# Altium schematic sheet cpu_nand.SchDoc: CPU I/O and NAND
size B; Engineer: Michael J. Kelly; Organization: CSB540otn - Outernet; Address1: AM335x Compute Board; Address2: (C) 2015; Address3: See us on the Web:; Address4: http://outernet.is; DocumentNumber: 3; Revision: V1.0; SheetNumber: 3; SheetTotal: 9
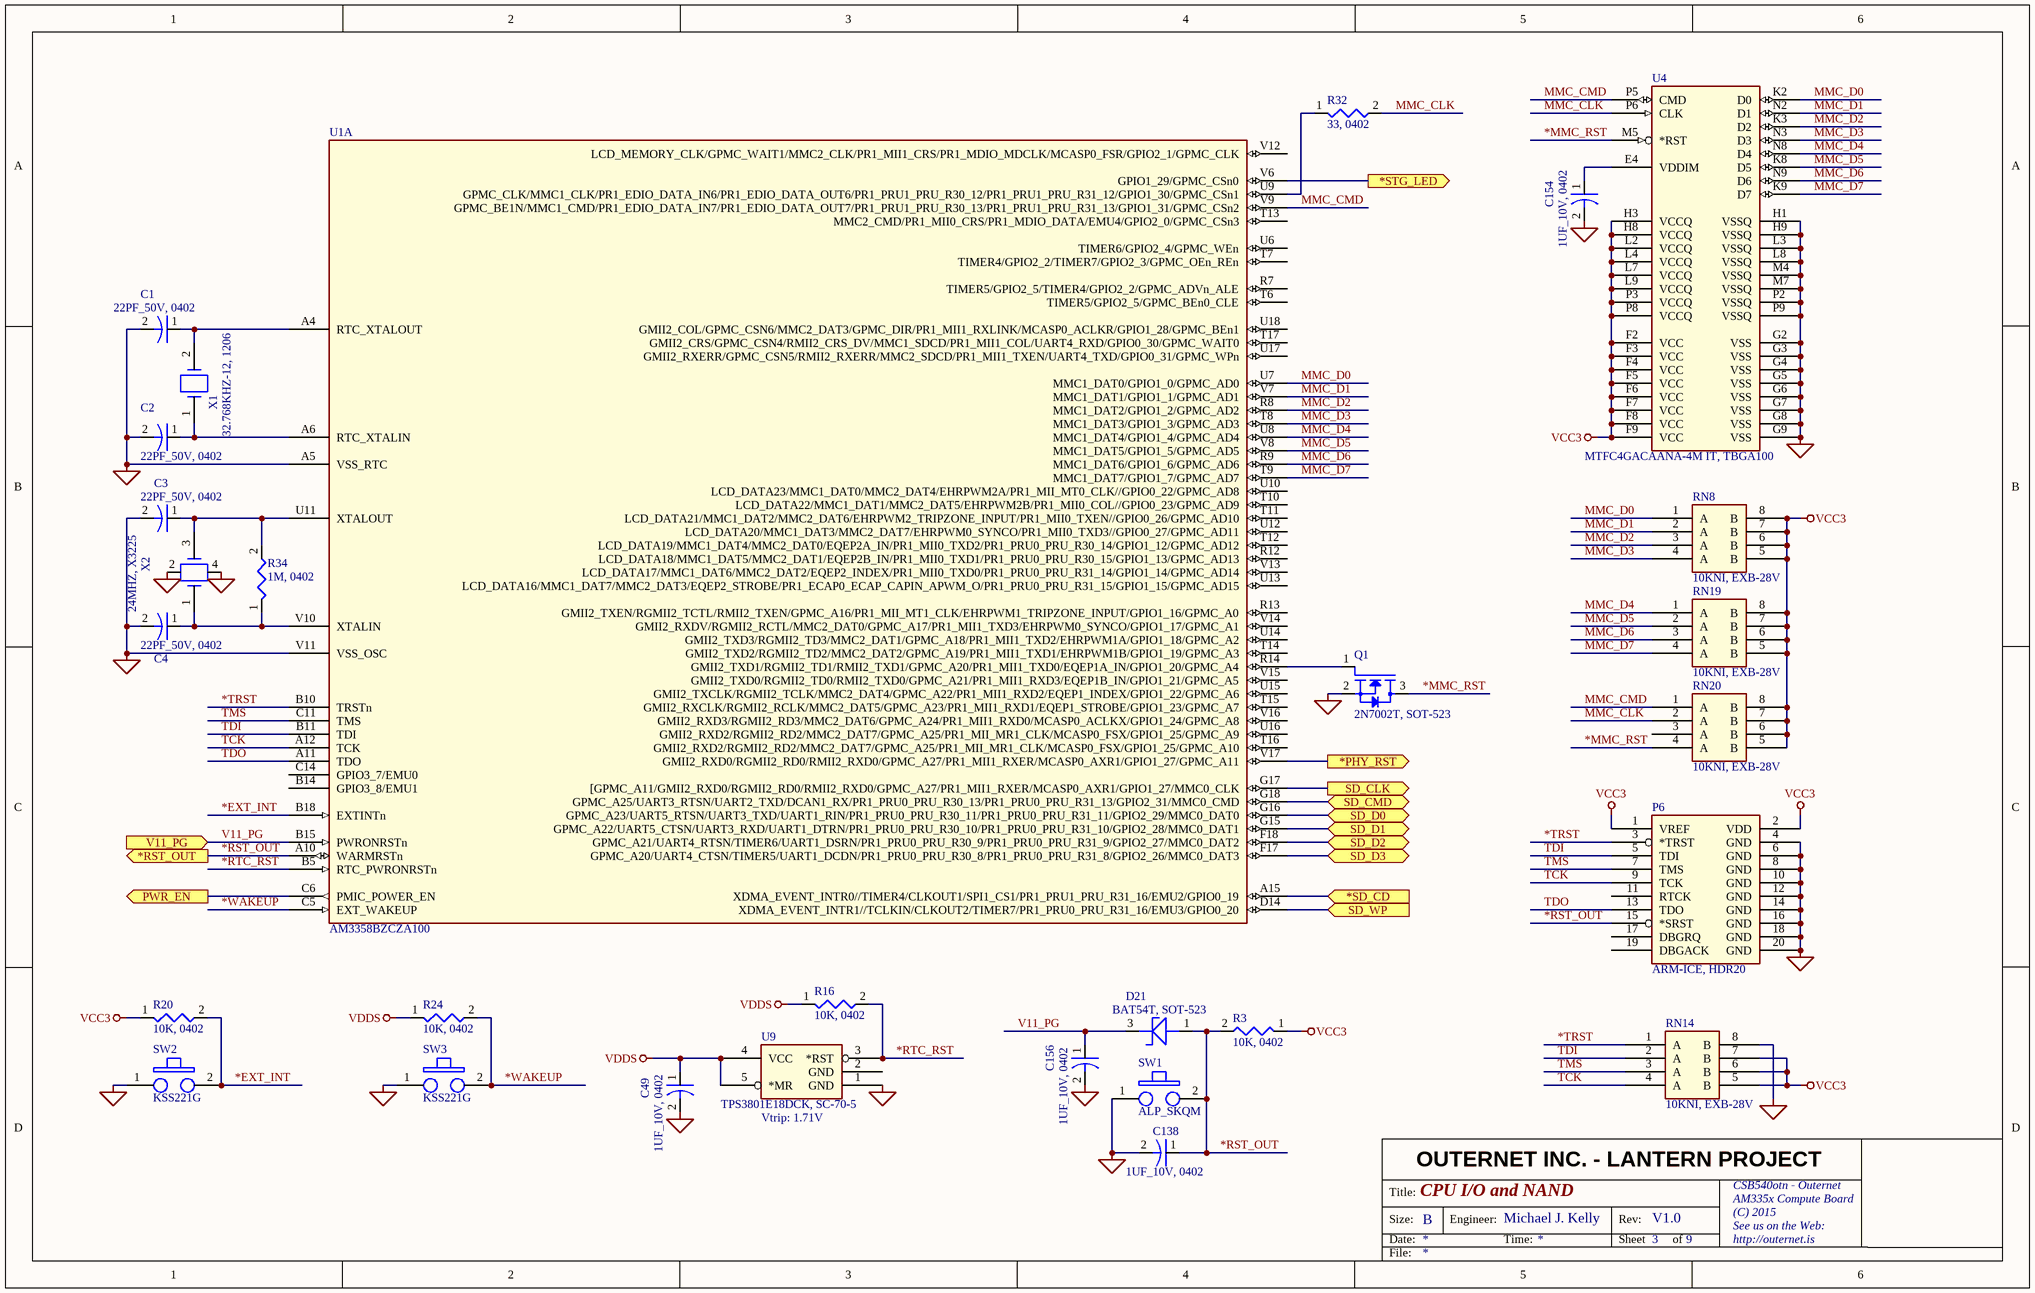
[diagram p0: cpu_nand.SchDoc]

## Parts
C1  22PF_50V, 0402  [0402C]
C2  22PF_50V, 0402  [0402C]
C3  22PF_50V, 0402  [0402C]
C4  22PF_50V, 0402  [0402C]
C49  1UF_10V, 0402  [0402C]
C138  1UF_10V, 0402  [0402C]
C154  1UF_10V, 0402  [0402C]
C156  1UF_10V, 0402  [0402C]
D21  BAT54T, SOT-523  [SOT-523]
P6  ARM-ICE, HDR20  [HDR20]
Q1  2N7002T, SOT-523  [SOT-523]
R3  10K, 0402  [0402R]
R16  10K, 0402  [0402R]
R20  10K, 0402  [0402R]
R24  10K, 0402  [0402R]
R32  33, 0402  [0402R]
R34  1M, 0402  [0402R]
RN8  10KNI, EXB-28V  [EXB-28V]
RN14  10KNI, EXB-28V  [EXB-28V]
RN19  10KNI, EXB-28V  [EXB-28V]
RN20  10KNI, EXB-28V  [EXB-28V]
SW1  ALP_SKQM  [ALPS_SKQM]
SW2  KSS221G  [KSS221G]
SW3  KSS221G  [KSS221G]
U1  AM3358BZCZA100  [BGA324x18]  (part A of 4)
U4  MTFC4GACAANA-4M IT, TBGA100  [TBGA100]
U9  TPS3801E18DCK, SC-70-5  Vtrip: 1.71V  [SOT-353/SC-70-5]
X1  32.768KHZ-12, 1206  [1206X]
X2  24MHZ, X3225  [X3225]

## Ports
*PHY_RST (out), *RST_OUT (out), *SD_CD (in), *STG_LED (out), PWR_EN (out), SD_CLK (out), SD_CMD (bidir), SD_D0 (bidir), SD_D1 (bidir), SD_D2 (bidir), SD_D3 (bidir), SD_WP (in), V11_PG (in)

## Nets
GND: C1.2 C2.2 C3.2 C4.2 C49.2 C138.2 C154.2 C156.2 P6.4(GND) P6.6(GND) P6.8(GND) P6.10(GND) P6.12(GND) P6.14(GND) P6.16(GND) P6.18(GND) P6.20(GND) Q1.2(SOURCE) RN14.8(B) SW1.1 SW2.1 SW3.1 U1.A5(VSS_RTC) U1.V11(VSS_OSC) U4.G2(VSS) U4.G3(VSS) U4.G4(VSS) U4.G5(VSS) U4.G6(VSS) U4.G7(VSS) U4.G8(VSS) U4.G9(VSS) U4.H1(VSSQ) U4.H9(VSSQ) U4.L3(VSSQ) U4.L8(VSSQ) U4.M4(VSSQ) U4.M7(VSSQ) U4.P2(VSSQ) U4.P9(VSSQ) U9.1(GND) X2.2 X2.4
VCC3: P6.1(VREF) P6.2(VDD) R3.1 R20.1 RN8.5(B) RN8.6(B) RN8.7(B) RN8.8(B) RN14.5(B) RN14.6(B) RN14.7(B) RN19.5(B) RN19.6(B) RN19.7(B) RN19.8(B) RN20.5(B) RN20.6(B) RN20.7(B) RN20.8(B) U4.F2(VCC) U4.F3(VCC) U4.F4(VCC) U4.F5(VCC) U4.F6(VCC) U4.F7(VCC) U4.F8(VCC) U4.F9(VCC) U4.H3(VCCQ) U4.H8(VCCQ) U4.L2(VCCQ) U4.L4(VCCQ) U4.L7(VCCQ) U4.L9(VCCQ) U4.P3(VCCQ) U4.P8(VCCQ)
VDDS: C49.1 R16.1 R24.1 U9.4(VCC) U9.5(*MR)
*EXT_INT: R20.2 SW2.2 U1.B18(EXTINTn)
*MMC_RST: Q1.3(DRAIN) RN20.4(A) U4.M5(*RST)
*PHY_RST: U1.V17(GMII2_RXD0/RGMII2_RD0/RMII2_RXD0/GPMC_A27/PR1_MII1_RXER/MCASP0_AXR1/GPIO1_27/GPMC_A11) ; port *PHY_RST
*RST_OUT: C138.1 D21.1(ANODE) P6.15(*SRST) R3.2 SW1.2 U1.A10(WARMRSTn) ; port *RST_OUT
*RTC_RST: R16.2 U1.B5(RTC_PWRONRSTn) U9.3(*RST)
*SD_CD: U1.A15(XDMA_EVENT_INTR0//TIMER4/CLKOUT1/SPI1_CS1/PR1_PRU1_PRU_R31_16/EMU2/GPIO0_19) ; port *SD_CD
*STG_LED: U1.V6(GPIO1_29/GPMC_CSn0) ; port *STG_LED
*TRST: P6.3(*TRST) RN14.1(A) U1.B10(TRSTn)
*WAKEUP: R24.2 SW3.2 U1.C5(EXT_WAKEUP)
MMC_CLK: R32.2 RN20.2(A) U4.P6(CLK)
MMC_CMD: RN20.1(A) U1.V9(GPMC_BE1N/MMC1_CMD/PR1_EDIO_DATA_IN7/PR1_EDIO_DATA_OUT7/PR1_PRU1_PRU_R30_13/PR1_PRU1_PRU_R31_13/GPIO1_31/GPMC_CSn2) U4.P5(CMD)
MMC_D0: RN8.1(A) U1.U7(MMC1_DAT0/GPIO1_0/GPMC_AD0) U4.K2(D0)
MMC_D1: RN8.2(A) U1.V7(MMC1_DAT1/GPIO1_1/GPMC_AD1) U4.N2(D1)
MMC_D2: RN8.3(A) U1.R8(MMC1_DAT2/GPIO1_2/GPMC_AD2) U4.K3(D2)
MMC_D3: RN8.4(A) U1.T8(MMC1_DAT3/GPIO1_3/GPMC_AD3) U4.N3(D3)
MMC_D4: RN19.1(A) U1.U8(MMC1_DAT4/GPIO1_4/GPMC_AD4) U4.N8(D4)
MMC_D5: RN19.2(A) U1.V8(MMC1_DAT5/GPIO1_5/GPMC_AD5) U4.K8(D5)
MMC_D6: RN19.3(A) U1.R9(MMC1_DAT6/GPIO1_6/GPMC_AD6) U4.N9(D6)
MMC_D7: RN19.4(A) U1.T9(MMC1_DAT7/GPIO1_7/GPMC_AD7) U4.K9(D7)
PWR_EN: U1.C6(PMIC_POWER_EN) ; port PWR_EN
SD_CLK: U1.G17([GPMC_A11/GMII2_RXD0/RGMII2_RD0/RMII2_RXD0/GPMC_A27/PR1_MII1_RXER/MCASP0_AXR1/GPIO1_27/MMC0_CLK) ; port SD_CLK
SD_CMD: U1.G18(GPMC_A25/UART3_RTSN/UART2_TXD/DCAN1_RX/PR1_PRU0_PRU_R30_13/PR1_PRU0_PRU_R31_13/GPIO2_31/MMC0_CMD) ; port SD_CMD
SD_D0: U1.G16(GPMC_A23/UART5_RTSN/UART3_TXD/UART1_RIN/PR1_PRU0_PRU_R30_11/PR1_PRU0_PRU_R31_11/GPIO2_29/MMC0_DAT0) ; port SD_D0
SD_D1: U1.G15(GPMC_A22/UART5_CTSN/UART3_RXD/UART1_DTRN/PR1_PRU0_PRU_R30_10/PR1_PRU0_PRU_R31_10/GPIO2_28/MMC0_DAT1) ; port SD_D1
SD_D2: U1.F18(GPMC_A21/UART4_RTSN/TIMER6/UART1_DSRN/PR1_PRU0_PRU_R30_9/PR1_PRU0_PRU_R31_9/GPIO2_27/MMC0_DAT2) ; port SD_D2
SD_D3: U1.F17(GPMC_A20/UART4_CTSN/TIMER5/UART1_DCDN/PR1_PRU0_PRU_R30_8/PR1_PRU0_PRU_R31_8/GPIO2_26/MMC0_DAT3) ; port SD_D3
SD_WP: U1.D14(XDMA_EVENT_INTR1//TCLKIN/CLKOUT2/TIMER7/PR1_PRU0_PRU_R31_16/EMU3/GPIO0_20) ; port SD_WP
TCK: P6.9(TCK) RN14.4(A) U1.A12(TCK)
TDI: P6.5(TDI) RN14.2(A) U1.B11(TDI)
TDO: P6.13(TDO) U1.A11(TDO)
TMS: P6.7(TMS) RN14.3(A) U1.C11(TMS)
V11_PG: C156.1 D21.3(CATHODE) U1.B15(PWRONRSTn) ; port V11_PG
NetC1_1: C1.1 U1.A4(RTC_XTALOUT) X1.2
NetC2_1: C2.1 U1.A6(RTC_XTALIN) X1.1
NetC3_1: C3.1 R34.2 U1.U11(XTALOUT) X2.3
NetC4_1: C4.1 R34.1 U1.V10(XTALIN) X2.1
NetC154_1: C154.1 U4.E4(VDDIM)
NetQ1_1: Q1.1(GATE) U1.R14(GMII2_TXD1/RGMII2_TD1/RMII2_TXD1/GPMC_A20/PR1_MII1_TXD0/EQEP1A_IN/GPIO1_20/GPMC_A4)
NetR32_1: R32.1 U1.U9(GPMC_CLK/MMC1_CLK/PR1_EDIO_DATA_IN6/PR1_EDIO_DATA_OUT6/PR1_PRU1_PRU_R30_12/PR1_PRU1_PRU_R31_12/GPIO1_30/GPMC_CSn1)

Not connected (* = marked no-connect by the designer): P6 11(RTCK) 17(DBGRQ) 19(DBGACK); RN20 3(A); U1 B14(GPIO3_8/EMU1) C14(GPIO3_7/EMU0) R7(TIMER5/GPIO2_5/TIMER4/GPIO2_2/GPMC_ADVn_ALE) R12(LCD_DATA18/MMC1_DAT5/MMC2_DAT1/EQEP2B_IN/PR1_MII0_TXD1/PR1_PRU0_PRU_R30_15/GPIO1_13/GPMC_AD13) R13(GMII2_TXEN/RGMII2_TCTL/RMII2_TXEN/GPMC_A16/PR1_MII_MT1_CLK/EHRPWM1_TRIPZONE_INPUT/GPIO1_16/GPMC_A0) T6(TIMER5/GPIO2_5/GPMC_BEn0_CLE) T7(TIMER4/GPIO2_2/TIMER7/GPIO2_3/GPMC_OEn_REn) T10(LCD_DATA22/MMC1_DAT1/MMC2_DAT5/EHRPWM2B/PR1_MII0_COL//GPIO0_23/GPMC_AD9) T11(LCD_DATA21/MMC1_DAT2/MMC2_DAT6/EHRPWM2_TRIPZONE_INPUT/PR1_MII0_TXEN//GPIO0_26/GPMC_AD10) T12(LCD_DATA19/MMC1_DAT4/MMC2_DAT0/EQEP2A_IN/PR1_MII0_TXD2/PR1_PRU0_PRU_R30_14/GPIO1_12/GPMC_AD12) T13(MMC2_CMD/PR1_MII0_CRS/PR1_MDIO_DATA/EMU4/GPIO2_0/GPMC_CSn3) T14(GMII2_TXD2/RGMII2_TD2/MMC2_DAT2/GPMC_A19/PR1_MII1_TXD1/EHRPWM1B/GPIO1_19/GPMC_A3) T15(GMII2_RXCLK/RGMII2_RCLK/MMC2_DAT5/GPMC_A23/PR1_MII1_RXD1/EQEP1_STROBE/GPIO1_23/GPMC_A7) T16(GMII2_RXD2/RGMII2_RD2/MMC2_DAT7/GPMC_A25/PR1_MII_MR1_CLK/MCASP0_FSX/GPIO1_25/GPMC_A10) T17(GMII2_CRS/GPMC_CSN4/RMII2_CRS_DV/MMC1_SDCD/PR1_MII1_COL/UART4_RXD/GPIO0_30/GPMC_WAIT0) U6(TIMER6/GPIO2_4/GPMC_WEn) U10(LCD_DATA23/MMC1_DAT0/MMC2_DAT4/EHRPWM2A/PR1_MII_MT0_CLK//GPIO0_22/GPMC_AD8) U12(LCD_DATA20/MMC1_DAT3/MMC2_DAT7/EHRPWM0_SYNCO/PR1_MII0_TXD3//GPIO0_27/GPMC_AD11) U13(LCD_DATA16/MMC1_DAT7/MMC2_DAT3/EQEP2_STROBE/PR1_ECAP0_ECAP_CAPIN_APWM_O/PR1_PRU0_PRU_R31_15/GPIO1_15/GPMC_AD15) U14(GMII2_TXD3/RGMII2_TD3/MMC2_DAT1/GPMC_A18/PR1_MII1_TXD2/EHRPWM1A/GPIO1_18/GPMC_A2) U15(GMII2_TXCLK/RGMII2_TCLK/MMC2_DAT4/GPMC_A22/PR1_MII1_RXD2/EQEP1_INDEX/GPIO1_22/GPMC_A6) U16(GMII2_RXD2/RGMII2_RD2/MMC2_DAT7/GPMC_A25/PR1_MII_MR1_CLK/MCASP0_FSX/GPIO1_25/GPMC_A9) U17(GMII2_RXERR/GPMC_CSN5/RMII2_RXERR/MMC2_SDCD/PR1_MII1_TXEN/UART4_TXD/GPIO0_31/GPMC_WPn) U18(GMII2_COL/GPMC_CSN6/MMC2_DAT3/GPMC_DIR/PR1_MII1_RXLINK/MCASP0_ACLKR/GPIO1_28/GPMC_BEn1) V12(LCD_MEMORY_CLK/GPMC_WAIT1/MMC2_CLK/PR1_MII1_CRS/PR1_MDIO_MDCLK/MCASP0_FSR/GPIO2_1/GPMC_CLK) V13(LCD_DATA17/MMC1_DAT6/MMC2_DAT2/EQEP2_INDEX/PR1_MII0_TXD0/PR1_PRU0_PRU_R31_14/GPIO1_14/GPMC_AD14) V14(GMII2_RXDV/RGMII2_RCTL/MMC2_DAT0/GPMC_A17/PR1_MII1_TXD3/EHRPWM0_SYNCO/GPIO1_17/GPMC_A1) V15(GMII2_TXD0/RGMII2_TD0/RMII2_TXD0/GPMC_A21/PR1_MII1_RXD3/EQEP1B_IN/GPIO1_21/GPMC_A5) V16(GMII2_RXD3/RGMII2_RD3/MMC2_DAT6/GPMC_A24/PR1_MII1_RXD0/MCASP0_ACLKX/GPIO1_24/GPMC_A8); U9 2(GND)

## Notes on the sheet
- OUTERNET INC. - LANTERN PROJECT
- Title:
- Size:
- Date:
- B
- Engineer:
- Time:
- Rev:
- Sheet
- of
- File:

## Library data of the parts
C1-C4 = 22PF_50V, 0402: CAP - 0402 PKG
C49 C138 C154 C156 = 1UF_10V, 0402: CAP - 0402 PKG
D21 = BAT54T, SOT-523: DIODE - SCHOTTKY, 30V, 200MA
P6 = ARM-ICE, HDR20: CONN - ARM JTAG CONNECTOR
Q1 = 2N7002T, SOT-523: N-FET - 60V, 500ma @ 10V, Vgs(th) 2V
R3 R16 R20 R24 = 10K, 0402: RES - 0402 PKG
R32 = 33, 0402: RES - 0402 PKG
R34 = 1M, 0402: RES - 0402 PKG
RN8 RN14 RN19 RN20 = 10KNI, EXB-28V: RES NET, 4 INDIVIDUAL, EXB-28V
SW1 = ALP_SKQM: SWITCH - PUSHBUTTON SMT, 6MM X 3.5MM
SW2 SW3 = KSS221G: SWITCH - PUSHBUTTON SMT, SIDE ACTUATED
U1 = AM3358BZCZA100: MPU - CORTEX-A8 CORE, SDIO, GIGe, USB x2, UART x3, CAN, 2D/3D
U4 = MTFC4GACAANA-4M IT, TBGA100: NAND FLASH - eMMC 4GB/8GB
U9 = TPS3801E18DCK, SC-70-5: IC - RESET, 1.71V, 200MSEC, MR INPUT, OPEN DRAIN OUTPUT
X1 = 32.768KHZ-12, 1206: CRYSTAL - SMT, 1206, 12.5PF, ABS07 PKG
X2 = 24MHZ, X3225: CRYSTAL - SMT, 3.2MM x 2.5MM, ABM8 PKG